# Altium schematic sheet i2c_miniproject_doesnt_work.SchDoc
size A4
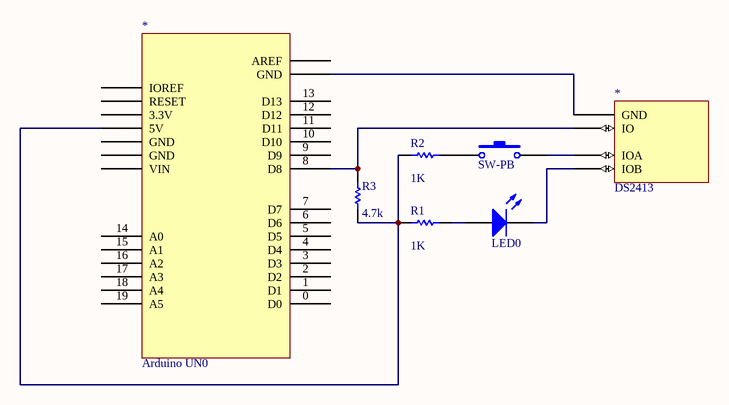
[diagram p0: i2c_miniproject_doesnt_work.SchDoc]

## Parts
(Parts that share a designator on the sheet are numbered #1, #2 ... from top to bottom, then left to right.)
*#1  Supplier Part Number 1: DS2413  (hidden comment: DS2413P+)
*#2  Arduino UN0
D?  LED0  [LED-0]
R1  value 1K  [AXIAL-0.3]  (hidden comment: Res1)
R2  value 1K  [AXIAL-0.3]  (hidden comment: Res1)
R3  value 4.7k  [AXIAL-0.3]  (hidden comment: Res1)
S?  SW-PB  [SPST-2]

## Nets
Net*#1_30: *#1.30(IOB) D?.2(K)
Net*#1_31: *#1.31(IOA) S?.2
Net*#1_32: *#1.32(IO) *#2.8(D8) R3.2
Net*#1_33: *#1.33(GND) *#2.?9(GND)
Net*#2_?4: *#2.?4(5V) R1.1 R2.1 R3.1
NetD?_1: D?.1(A) R1.2
NetR2_2: R2.2 S?.1

Not connected (* = marked no-connect by the designer): *#2 0(D0) 1(D1) 2(D2) 3(D3) 4(D4) 5(D5) 6(D6) 7(D7) 9(D9) 10(D10) 11(D11) 12(D12) 13(D13) 14(A0) 15(A1) 16(A2) 17(A3) 18(A4) 19(A5) ?1(IOREF) ?2(RESET) ?3(3.3V) ?5(GND) ?6(GND) ?7(VIN) ?8(AREF)

## Library data of the parts
*#1 = DS2413P+: MAXIM INTEGRATED PRODUCTS   DS2413P+.   IC, DUAL CHANNEL ADDRESSABLE SW, TSOC-6; Min Supply Voltage: 2.8V; Max Supply Voltage: 5.25V; Operating Supply Current: 70uA; On-State Resistance: 20R; Quiescent Current: 24uA; Low Level Output Current: 20mA; Throw Configuration: SPST; Supplier 1: Digi-Key; Manufacturer: Maxim; Manufacturer Part Number: DS2413P+; RoHS: Yes; Category: Memory; Stock 1: 5230; Pricing 1: 1=3.09000, 10=2.77500, 25=2.62360, 100=2.15710, 250=1.93556, 500=1.86560, 1000=1.55078, 2500=1.49248, 5000=1.48500 (USD); Mount: Surface Mount; Number of Pins: 6; Contact Plating: Tin,Matte; Min Operating Temperature: 0°C; Max Operating Temperature: 70°C; Packaging: Rail/Tube; Package Quantity: 120; Series: -; Length: 4mm; Width: 3.89mm; Height: 1.35mm; Radiation Hardening: No; RoHS Compliant: Yes; Lead Free: Lead Free; REACH SVHC: Unknown; ComponentLink1URL: https://datasheet.ciiva.com/14100/07386164-14100015.pdf?src-supplier=Distrelec; ComponentLink1Description: https://datasheet.ciiva.com/14100/07386164-14100015.pdf?src-supplier=Distrelec; ComponentLink2URL: https://datasheet.ciiva.com/2080/ds2413-2080624.pdf?src-supplier=Digi-Key; ComponentLink2Description: https://datasheet.ciiva.com/2080/ds2413-2080624.pdf?src-supplier=Digi-Key; ComponentLink3URL: https://datasheet.ciiva.com/1176/ds2413-1176081.pdf?src-supplier=Newark; ComponentLink3Description: https://datasheet.ciiva.com/1176/ds2413-1176081.pdf?src-supplier=Newark; ComponentLink4URL: https://datasheet.ciiva.com/1171/ds2413-1171804.pdf?src-supplier=Farnell; ComponentLink4Description: https://datasheet.ciiva.com/1171/ds2413-1171804.pdf?src-supplier=Farnell; ComponentLink5URL: https://datasheet.ciiva.com/1168/1911564-1168205.pdf?src-supplier=Element14; ComponentLink5Description: https://datasheet.ciiva.com/1168/1911564-1168205.pdf?src-supplier=Element14; ComponentLink6URL: https://datasheet.ciiva.com/16617/ds2413-16617017.pdf?src-supplier=Avnet+Europe; ComponentLink6Description: https://datasheet.ciiva.com/16617/ds2413-16617017.pdf?src-supplier=Avnet+Europe
D? = LED0: Typical INFRARED GaAs LED; Published: 8-Jun-2000; LatestRevisionDate: 08-Jul-2005; LatestRevisionNote: Mech Layer 1 removed.; PackageReference: LED-0; Publisher: Altium Limited; PackageDescription: LED; 2 Leads
R1-R3 = Res1: Resistor; Published: 8-Jun-2000; LatestRevisionDate: 17-Jul-2002; LatestRevisionNote: Re-released for DXP Platform.; PackageReference: AXIAL-0.3; Publisher: Altium Limited; PackageDescription: Axial Device, Thru-Hole; 2 Leads; 0.3 in Pin Spacing
S? = SW-PB: Switch; Published: 24-Mar-1999; LatestRevisionDate: 17-Jul-2002; LatestRevisionNote: Re-released for DXP Platform.; PackageReference: SPST-2; Publisher: Altium Limited; PackageDescription: Switch; 2 Leads